# EAGLE design controlshield (EAGLE 6.3)
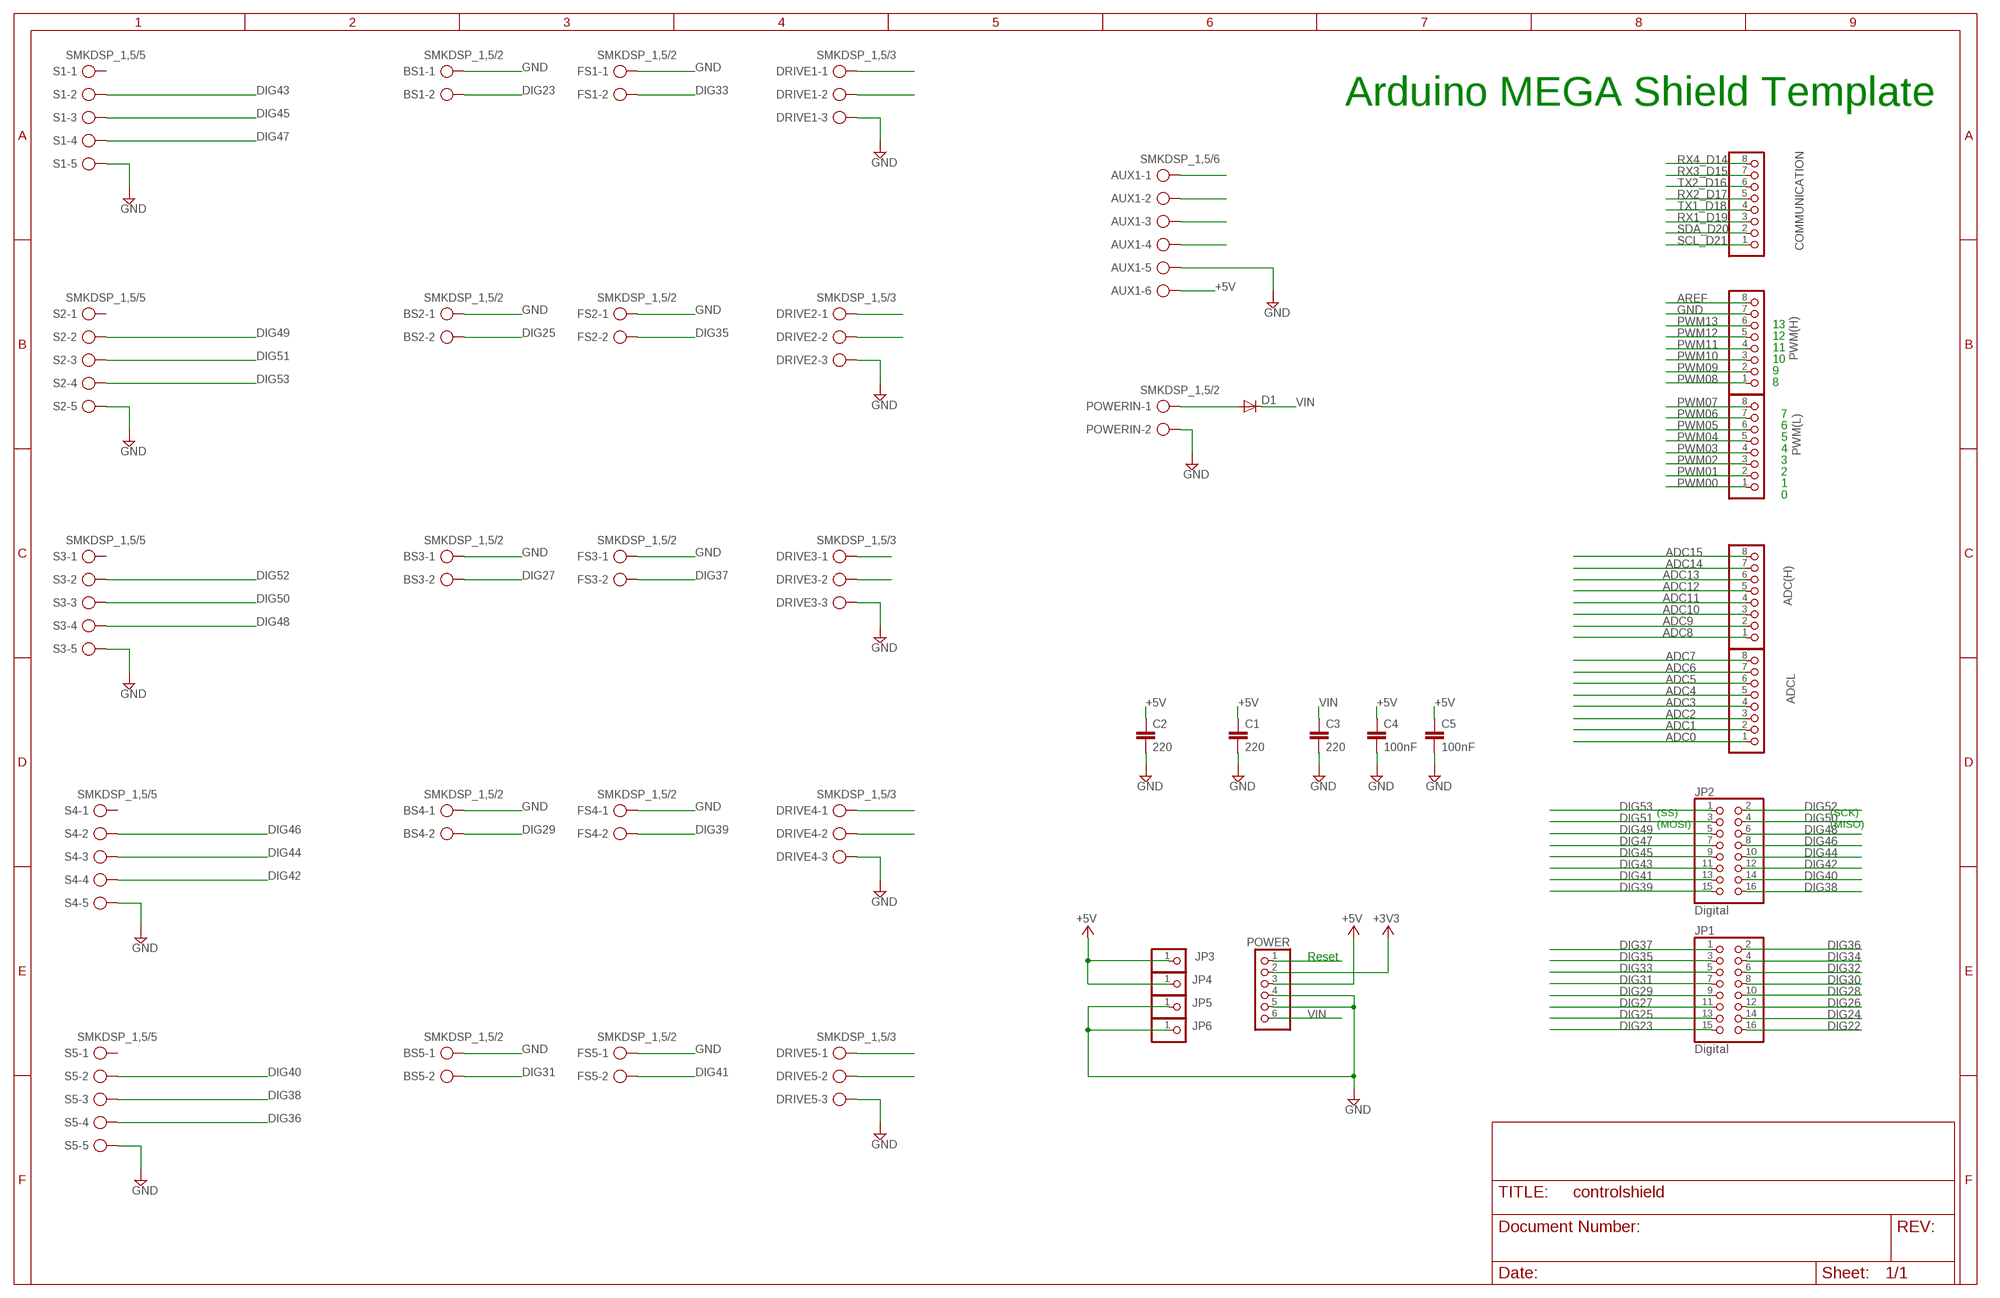
[diagram p0: schematic, sheet 1]

## Parts
ADC(H)  PINHD-1X8  [1X08]
ADCL  PINHD-1X8  [1X08]
AUX1  SMKDSP_1,5/6  [SMKDSP_1,5/6]
BS1  SMKDSP_1,5/2  [SMKDSP_1,5/2]
BS2  SMKDSP_1,5/2  [SMKDSP_1,5/2]
BS3  SMKDSP_1,5/2  [SMKDSP_1,5/2]
BS4  SMKDSP_1,5/2  [SMKDSP_1,5/2]
BS5  SMKDSP_1,5/2  [SMKDSP_1,5/2]
C1  220  C-EU050-075X075  [C050-075X075]
C2  220  C-EU050-075X075  [C050-075X075]
C3  220  C-EU050-075X075  [C050-075X075]
C4  100nF  CAPPTH1  [CAP-PTH-5MM]
C5  100nF  CAPPTH1  [CAP-PTH-5MM]
COMMUNICATION  PINHD-1X8  [1X08]
D1  DIODE-DO201-15  [DO201-15]
DRIVE1  SMKDSP_1,5/3  [SMKDSP_1,5/3]
DRIVE2  SMKDSP_1,5/3  [SMKDSP_1,5/3]
DRIVE3  SMKDSP_1,5/3  [SMKDSP_1,5/3]
DRIVE4  SMKDSP_1,5/3  [SMKDSP_1,5/3]
DRIVE5  SMKDSP_1,5/3  [SMKDSP_1,5/3]
FS1  SMKDSP_1,5/2  [SMKDSP_1,5/2]
FS2  SMKDSP_1,5/2  [SMKDSP_1,5/2]
FS3  SMKDSP_1,5/2  [SMKDSP_1,5/2]
FS4  SMKDSP_1,5/2  [SMKDSP_1,5/2]
FS5  SMKDSP_1,5/2  [SMKDSP_1,5/2]
JP1  Digital  PINHD-2X8  [2X08]
JP2  Digital  PINHD-2X8  [2X08]
JP3  PINHD-1X1  [1X01]
JP4  PINHD-1X1  [1X01]
JP5  PINHD-1X1  [1X01]
JP6  PINHD-1X1  [1X01]
POWER  PINHD-1X6  [1X06]
POWERIN  SMKDSP_1,5/2  [SMKDSP_1,5/2]
PWM(H)  PINHD-1X8  [1X08]
PWM(L)  PINHD-1X8  [1X08]
S1  SMKDSP_1,5/5  [SMKDSP_1,5/5]
S2  SMKDSP_1,5/5  [SMKDSP_1,5/5]
S3  SMKDSP_1,5/5  [SMKDSP_1,5/5]
S4  SMKDSP_1,5/5  [SMKDSP_1,5/5]
S5  SMKDSP_1,5/5  [SMKDSP_1,5/5]

## Nets
+3V3 [power]: POWER.2
+5V [usbvcc]: AUX1.6 C1.1 C2.1 C4.1 C5.1 JP3.1 JP4.1 POWER.3
ADC0: ADCL.1
ADC1: ADCL.2
ADC2: ADCL.3
ADC3: ADCL.4
ADC4: ADCL.5
ADC5: ADCL.6
ADC6: ADCL.7
ADC7: ADCL.8
ADC8: ADC(H).1
ADC9: ADC(H).2
ADC10: ADC(H).3
ADC11: ADC(H).4
ADC12: ADC(H).5
ADC13: ADC(H).6
ADC14: ADC(H).7
ADC15: ADC(H).8
AREF: PWM(H).8
DIG22: DRIVE1.1 JP1.16
DIG23: BS1.2 JP1.15
DIG24: DRIVE1.2 JP1.14
DIG25: BS2.2 JP1.13
DIG26 [gnd]: DRIVE2.1 JP1.12
DIG27: BS3.2 JP1.11
DIG28: DRIVE2.2 JP1.10
DIG29: BS4.2 JP1.9
DIG30: JP1.8
DIG31: BS5.2 JP1.7
DIG32: JP1.6
DIG33: FS1.2 JP1.5
DIG34: JP1.4
DIG35: FS2.2 JP1.3
DIG36: JP1.2 S5.4
DIG37: FS3.2 JP1.1
DIG38: JP2.16 S5.3
DIG39: FS4.2 JP2.15
DIG40: JP2.14 S5.2
DIG41: FS5.2 JP2.13
DIG42: JP2.12 S4.4
DIG43: JP2.11 S1.2
DIG44: JP2.10 S4.3
DIG45: JP2.9 S1.3
DIG46: JP2.8 S4.2
DIG47: JP2.7 S1.4
DIG48: JP2.6 S3.4
DIG49: JP2.5 S2.2
DIG50: JP2.4 S3.3
DIG51: JP2.3 S2.3
DIG52: JP2.2 S3.2
DIG53: JP2.1 S2.4
GND [gnd]: AUX1.5 BS1.1 BS2.1 BS3.1 BS4.1 BS5.1 C1.2 C2.2 C3.2 C4.2 C5.2 DRIVE1.3 DRIVE2.3 DRIVE3.3 DRIVE4.3 DRIVE5.3 FS1.1 FS2.1 FS3.1 FS4.1 FS5.1 JP5.1 JP6.1 POWER.4 POWER.5 POWERIN.2 PWM(H).7 S1.5 S2.5 S3.5 S4.5 S5.5
N$1: D1.A POWERIN.1
PWM00: PWM(L).1
PWM01: PWM(L).2
PWM02: PWM(L).3
PWM03: DRIVE3.1 PWM(L).4
PWM04: DRIVE3.2 PWM(L).5
PWM05: DRIVE4.1 PWM(L).6
PWM06: DRIVE4.2 PWM(L).7
PWM07: DRIVE5.1 PWM(L).8
PWM08: DRIVE5.2 PWM(H).1
PWM09: AUX1.1 PWM(H).2
PWM10: AUX1.2 PWM(H).3
PWM11: AUX1.3 PWM(H).4
PWM12: AUX1.4 PWM(H).5
PWM13: PWM(H).6
RESET: POWER.1
RX1_D19: COMMUNICATION.3
RX2_D17: COMMUNICATION.5
RX3_D15: COMMUNICATION.7
RX4_D14: COMMUNICATION.8
SCL_D21: COMMUNICATION.1
SDA_D20: COMMUNICATION.2
TX1_D18: COMMUNICATION.4
TX2_D16: COMMUNICATION.6
VIN [power]: C3.1 D1.C POWER.6
Unconnected: S1.1 S2.1 S3.1 S4.1 S5.1

## Notes on the sheet
- Arduino MEGA Shield Template
- 13
- 12
- 11
- 10
- 9
- 8
- 7
- 6
- 5
- 4
- 3
- 2
- 1
- 0
- (SS) | (SCK)
- (MOSI) | (MISO)
- Reset

## Library data of the parts
ADC(H) ADCL COMMUNICATION PWM(H) PWM(L) = pinhead:PINHD-1X8: PIN HEADER
AUX1 = con-phoenix-smkdsp:SMKDSP_1,5/6: Printklemme, Nennstrom: 17,5 A, Bemessungsspannung: 250 V, Raster: 5,0 mm Source: http://eshop.phoenixcontact.de .. 1733415.pdf; MF: FARNELL; MPN: 1733619; OC_FARNELL: 3041270; OC_NEWARK: 71C4132
BS1-BS5 FS1-FS5 POWERIN = con-phoenix-smkdsp:SMKDSP_1,5/2: Printklemme, Nennstrom: 17,5 A, Bemessungsspannung: 250 V, Raster: 5,0 mm Source: http://eshop.phoenixcontact.de .. 1733415.pdf; MF: FARNELL; MPN: 1733570; OC_FARNELL: 3041244; OC_NEWARK: 69C8588
C1-C3 = rcl:C-EU: CAPACITOR, European symbol
C4 C5 = SparkFun-Capacitors:CAP: Capacitor Standard 0603 ceramic capacitor, and 0.1" leaded capacitor.
D1 = diode:DIODE-: DIODE
DRIVE1-DRIVE5 = con-phoenix-smkdsp:SMKDSP_1,5/3: Printklemme, Nennstrom: 17,5 A, Bemessungsspannung: 250 V, Raster: 5,0 mm Source: http://eshop.phoenixcontact.de .. 1733415.pdf; MF: FARNELL; MPN: 1733583; OC_FARNELL: 3041256; OC_NEWARK: 71C4130
JP1 JP2 = pinhead:PINHD-2X8: PIN HEADER
JP3-JP6 = pinhead:PINHD-1X1: PIN HEADER
POWER = pinhead:PINHD-1X6: PIN HEADER
S1-S5 = con-phoenix-smkdsp:SMKDSP_1,5/5: Printklemme, Nennstrom: 17,5 A, Bemessungsspannung: 250 V, Raster: 5,0 mm Source: http://eshop.phoenixcontact.de .. 1733415.pdf; OC_FARNELL: unknown; OC_NEWARK: unknown

## Net classes
0 default: width 0.203 mm, drill 0.406 mm, clearance 0.203 mm
1 power: width 0.61 mm, drill 0.711 mm, clearance 0.203 mm
2 gnd: width 0.305 mm, drill 0.711 mm, clearance 0.203 mm
3 usbvcc: width 0.508 mm, drill 0.711 mm, clearance 0.203 mm

## Board
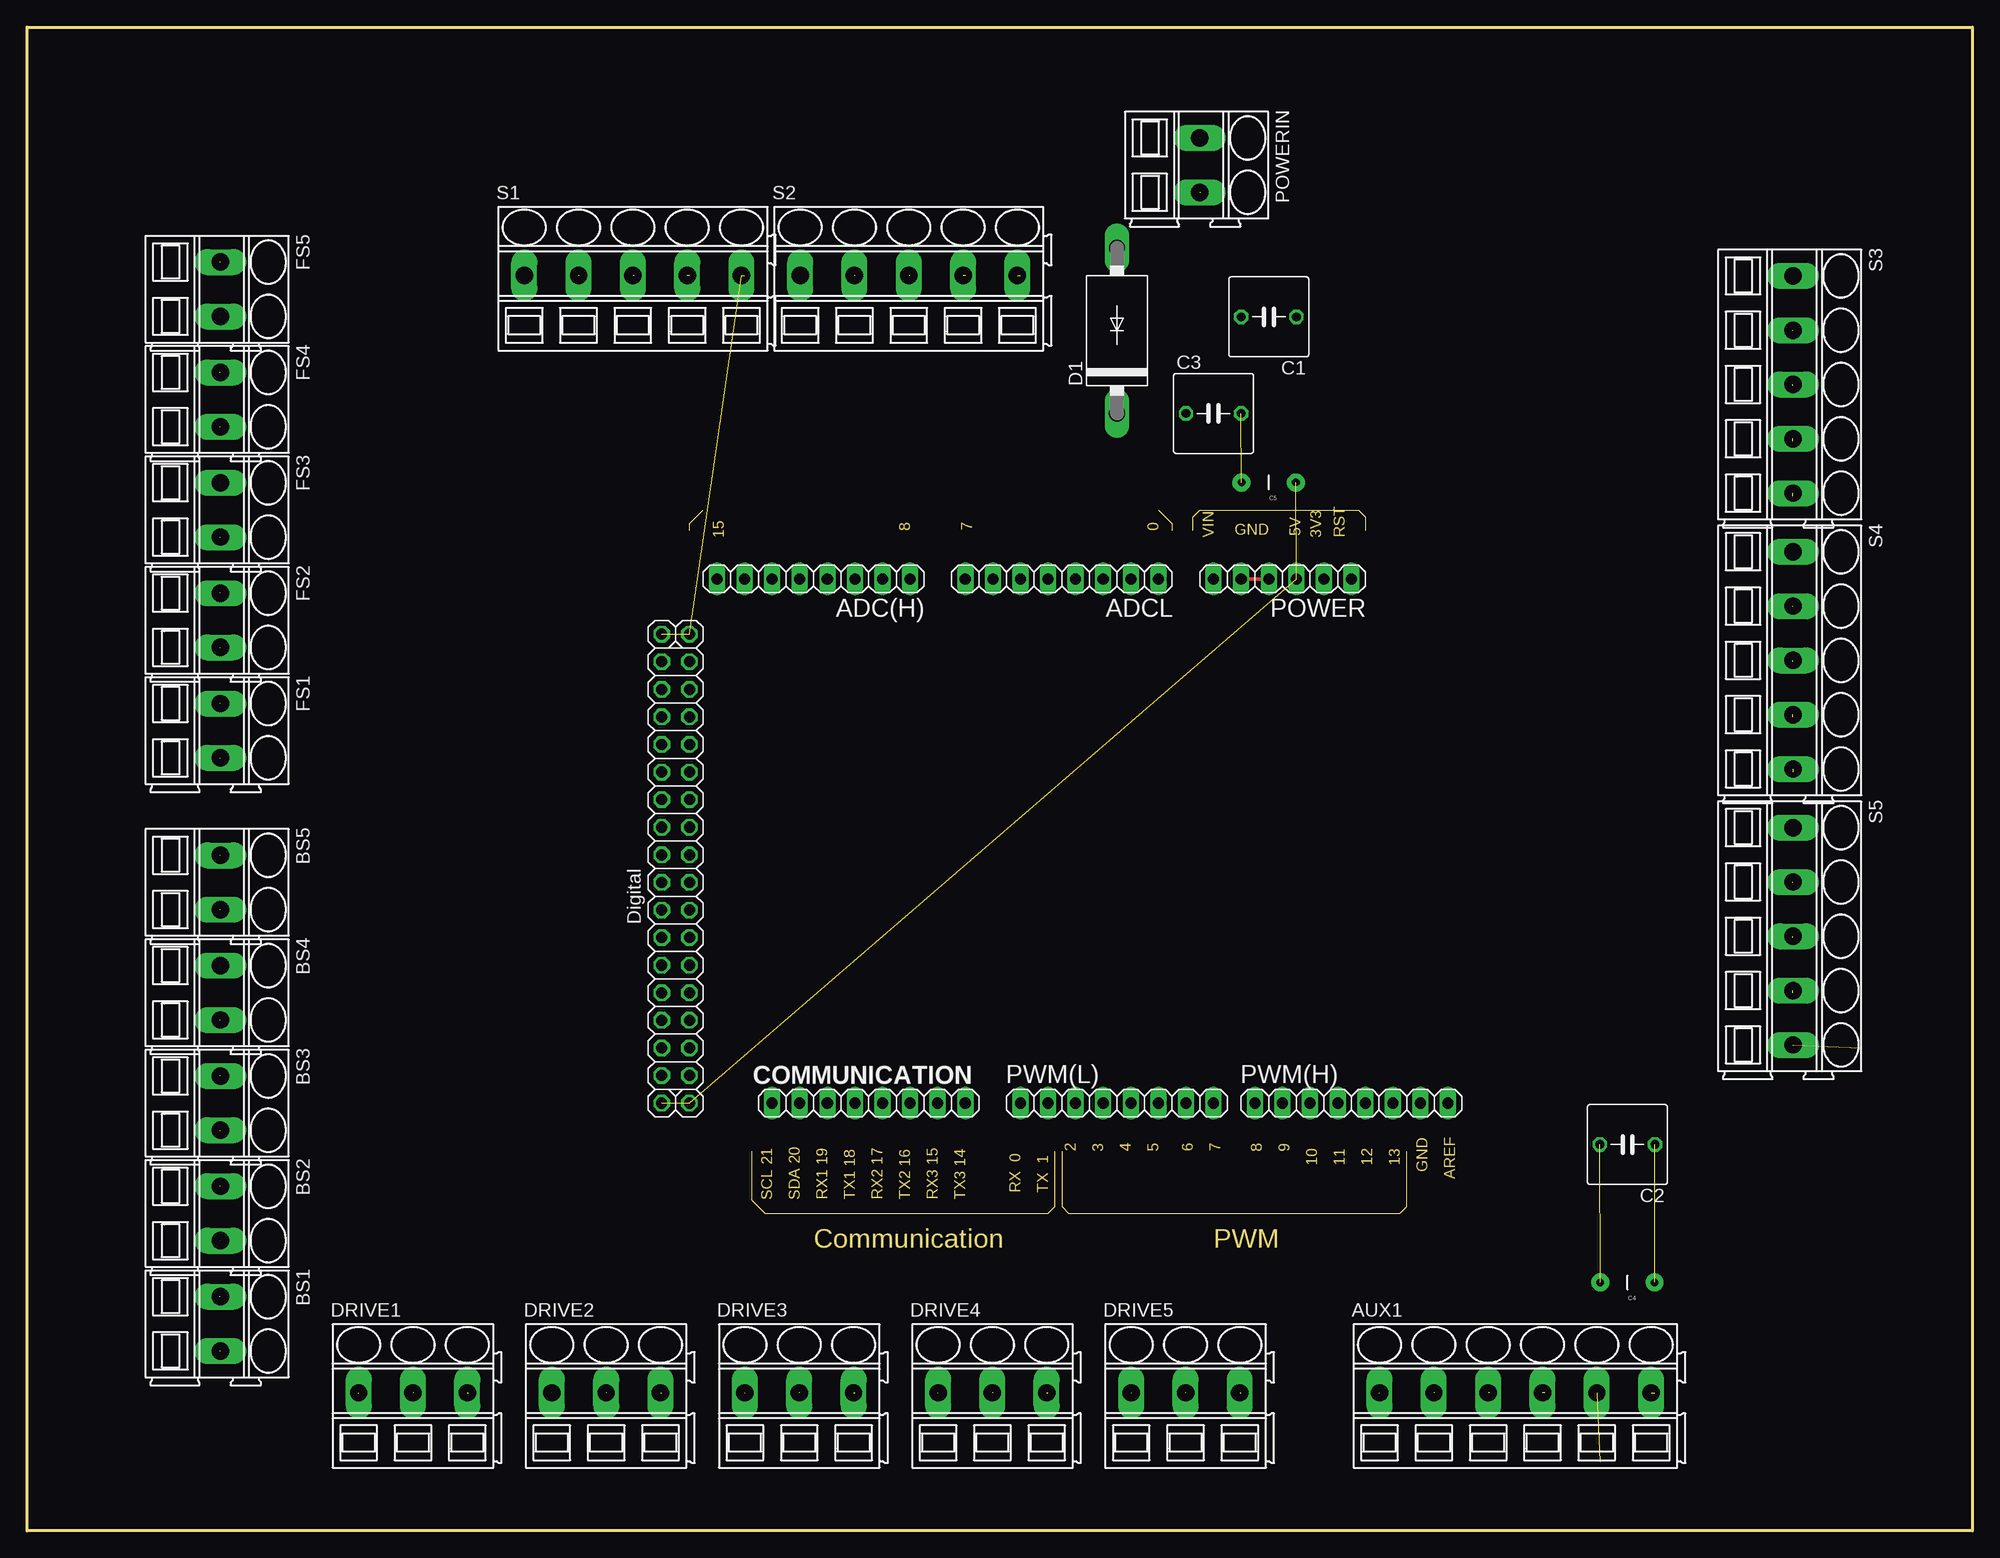
[diagram p1: board, top side]
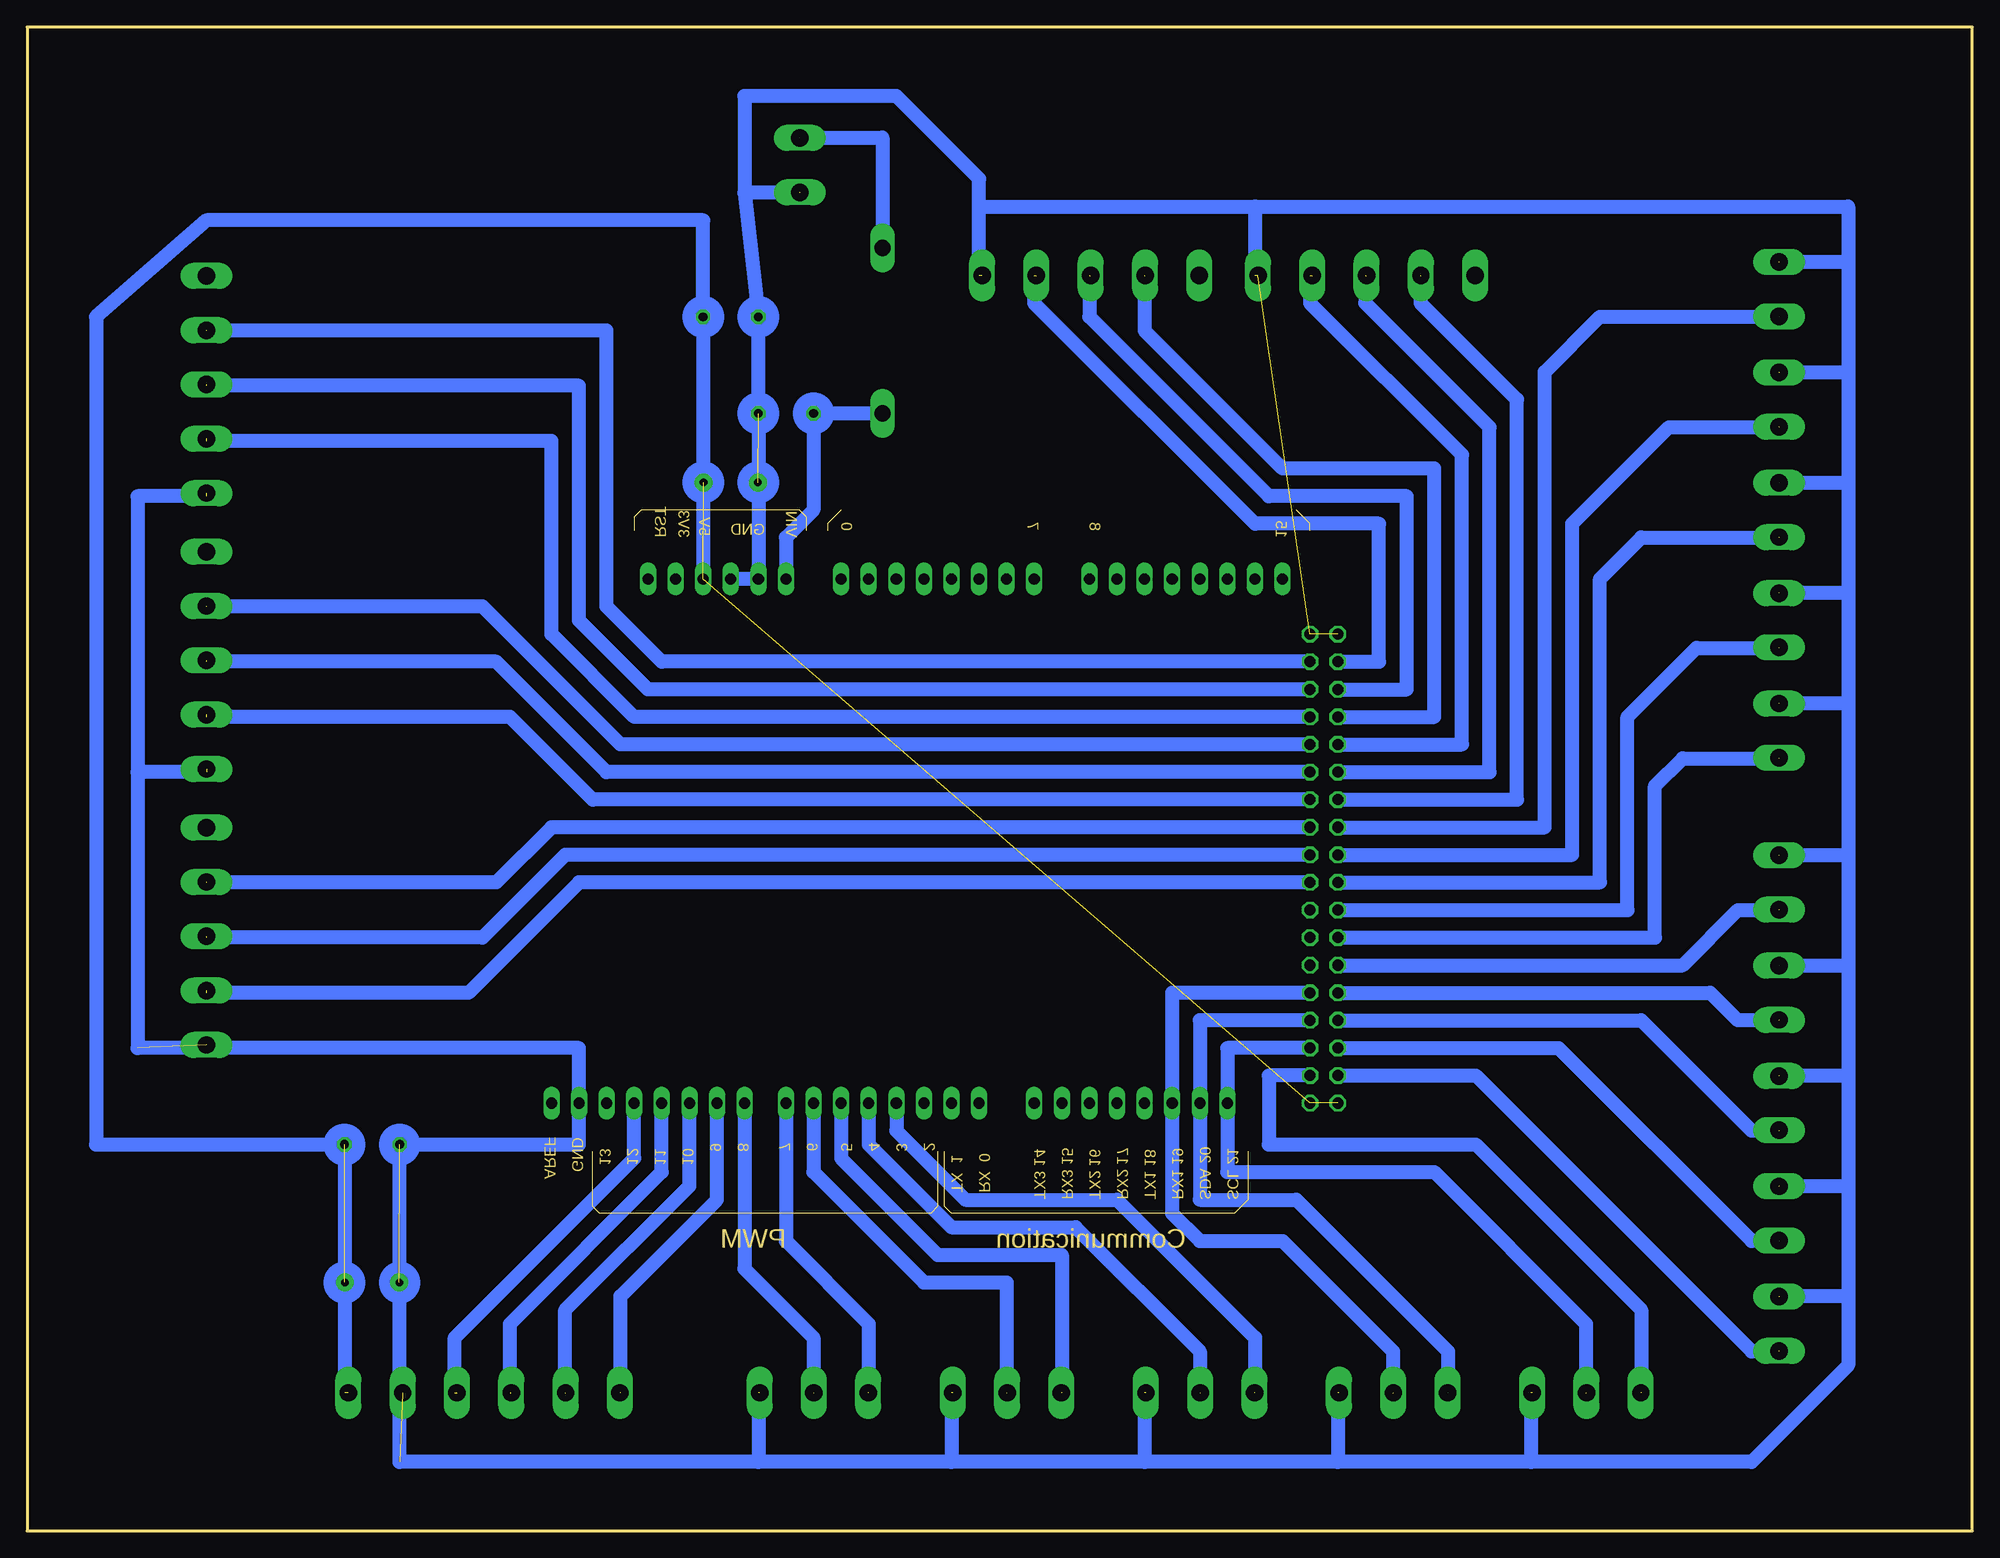
[diagram p2: board, bottom side, seen from below]

Size 179.07 x 138.43 mm. Coordinates in mm from the lower left corner, seen from the top.
Outline: 60.96,92.08 60.96,92.71 62.23,93.98
Outline: 104.14,93.98 105.41,92.71 105.41,92.08
Outline: 107.31,92.08 107.31,93.34 107.95,93.98 122.56,93.98 123.19,93.34 123.19,92.08
Outline: 66.68,34.92 66.68,30.48 67.95,29.21 93.98,29.21 94.62,29.84 94.62,34.92
Outline: 95.25,34.92 95.25,29.84 95.89,29.21 126.37,29.21 127,29.84 127,34.92
Outline: 179.07,0 0,0 0,138.43 179.07,138.43 179.07,0
Copper layers (1*16): Top 0.035mm / dielectric 1.5mm / Bottom 0.035mm
Design rules "default *": minimum track width 8mil, minimum drill 16mil, track to track 10mil, track to pad 8mil, pad to pad 8mil, via to via 10mil, smd to smd 8mil, copper to edge 40mil, drill to drill 12mil, minimum pad ring 10mil, minimum via ring 10mil, stop-mask expansion 4mil, vias tented up to drill 0mil, thermal gap 10mil

### Footprints (pad centres in the part's own frame; a part is rotated, then mirrored left to right if it is on the bottom)
1X08 = drill 1.016 long: 1 -8.89,0; 2 -6.35,0; 3 -3.81,0; 4 -1.27,0; 5 1.27,0; 6 3.81,0; 7 6.35,0; 8 8.89,0
SMKDSP_1,5/6 = drill 1.6 pad 1.8 long: 1 -2.5,0; 2 2.5,0; 3 7.5,0; 4 12.5,0; 5 17.5,0; 6 22.5,0
SMKDSP_1,5/2 = drill 1.6 pad 1.8 long: 1 -2.5,0; 2 2.5,0
C050-075X075 = drill 0.813 octagon: 1 -2.54,0; 2 2.54,0
CAP-PTH-5MM = drill 0.7 pad 1.651: 1 -2.5,0; 2 2.5,0
DO201-15 = drill 1.499 long: A 7.62,0; C -7.62,0
SMKDSP_1,5/3 = drill 1.6 pad 1.8 long: 1 -2.5,0; 2 2.5,0; 3 7.5,0
2X08 = drill 1.016 octagon: 1 -8.89,-1.27; 2 -8.89,1.27; 3 -6.35,-1.27; 4 -6.35,1.27; 5 -3.81,-1.27; 6 -3.81,1.27; 7 -1.27,-1.27; 8 -1.27,1.27; 9 1.27,-1.27; 10 1.27,1.27; 11 3.81,-1.27; 12 3.81,1.27; 13 6.35,-1.27; 14 6.35,1.27; 15 8.89,-1.27; 16 8.89,1.27
1X01 = drill 1.016 octagon: 1 0,0
1X06 = drill 1.016 long: 1 -6.35,0; 2 -3.81,0; 3 -1.27,0; 4 1.27,0; 5 3.81,0; 6 6.35,0
SMKDSP_1,5/5 = drill 1.6 pad 1.8 long: 1 -2.5,0; 2 2.5,0; 3 7.5,0; 4 12.5,0; 5 17.5,0

### Placement (x,y rotation side)
ADC(H)  72.39,87.63 180 top
ADCL  95.25,87.63 180 top
AUX1  127,12.7 0 top
BS1  17.78,19.05 270 top
BS2  17.78,29.21 270 top
BS3  17.78,39.37 270 top
BS4  17.78,49.53 270 top
BS5  17.78,59.69 270 top
C1  114.3,111.76 180 top
C2  147.32,35.56 180 top
C3  109.22,102.87 0 top
C4  147.32,22.86 180 top
C5  114.3,96.52 180 top
COMMUNICATION  77.47,39.37 0 top
D1  100.33,110.49 90 top
DRIVE1  33.02,12.7 0 top
DRIVE2  50.8,12.7 0 top
DRIVE3  68.58,12.7 0 top
DRIVE4  86.36,12.7 0 top
DRIVE5  104.14,12.7 0 top
FS1  17.78,73.66 270 top
FS2  17.78,83.82 270 top
FS3  17.78,93.98 270 top
FS4  17.78,104.14 270 top
FS5  17.78,114.3 270 top
JP1  59.69,50.8 270 top
JP2  59.69,71.12 270 top
JP3  60.96,39.37 180 top
JP4  58.42,39.37 180 top
JP5  60.96,82.55 180 top
JP6  58.42,82.55 180 top
POWER  115.57,87.63 180 top
POWERIN  107.95,125.73 270 top
PWM(H)  121.92,39.37 0 top
PWM(L)  100.33,39.37 0 top
S1  48.26,115.57 0 top
S2  73.66,115.57 0 top
S3  162.56,113.03 270 top
S4  162.56,87.63 270 top
S5  162.56,62.23 270 top

### Tracks (layer width: path | path; a pad name or v marks a point on that pad's centre or on a via)
+5V  (5 unrouted)
  Bottom 1.27: 149.86,12.7 C2.1 172.72,35.56 172.72,111.76 162.56,120.65 116.84,120.65 C1.1 POWER.3
DIG22  (1 unrouted)
  Bottom 1.27: JP1.16 64.77,41.91 64.77,35.56 45.72,35.56 30.48,20.32 30.48,12.7
DIG23  (1 unrouted)
  Bottom 1.27: JP1.15 45.72,41.91 20.32,16.51 17.78,16.51
DIG24  (1 unrouted)
  Bottom 1.27: JP1.14 68.58,44.45 68.58,33.02 49.53,33.02 35.56,19.05 35.56,12.7
DIG25  (1 unrouted)
  Bottom 1.27: JP1.13 38.1,44.45 20.32,26.67 17.78,26.67
DIG26  (1 unrouted)
  Bottom 1.27: JP1.12 71.12,46.99 71.12,30.48 62.23,30.48 48.26,16.51 48.26,12.7
DIG27  (1 unrouted)
  Bottom 1.27: JP1.11 30.48,46.99 20.32,36.83 17.78,36.83
DIG28  (1 unrouted)
  Bottom 1.27: JP1.10 73.66,49.53 73.66,29.21 71.12,26.67 63.5,26.67 53.34,16.51 53.34,12.7
DIG29  (1 unrouted)
  Bottom 1.27: JP1.9 24.13,49.53 21.59,46.99 17.78,46.99
DIG31  (1 unrouted)
  Bottom 1.27: JP1.7 26.67,52.07 21.59,57.15 17.78,57.15
DIG33  (1 unrouted)
  Bottom 1.27: JP1.5 29.21,54.61 29.21,68.58 26.67,71.12 17.78,71.12
DIG35  (1 unrouted)
  Bottom 1.27: JP1.3 31.75,57.15 31.75,74.93 25.4,81.28 17.78,81.28
DIG36  (1 unrouted)
  Bottom 1.27: JP1.2 128.27,59.69 138.43,49.53 162.56,49.53
DIG37  (1 unrouted)
  Bottom 1.27: JP1.1 34.29,59.69 34.29,87.63 30.48,91.44 17.78,91.44
DIG38  (1 unrouted)
  Bottom 1.27: JP2.16 129.54,62.23 137.16,54.61 162.56,54.61
DIG39  (1 unrouted)
  Bottom 1.27: JP2.15 36.83,62.23 36.83,92.71 27.94,101.6 17.78,101.6
DIG40  (1 unrouted)
  Bottom 1.27: JP2.14 130.81,64.77 135.89,59.69 162.56,59.69
DIG41  (1 unrouted)
  Bottom 1.27: JP2.13 39.37,64.77 39.37,106.68 34.29,111.76 17.78,111.76
DIG42  (1 unrouted)
  Bottom 1.27: JP2.12 127,67.31 134.62,74.93 162.56,74.93
DIG43  (1 unrouted)
  Bottom 1.27: JP2.11 41.91,67.31 41.91,104.14 50.8,113.03 50.8,115.57
DIG44  (1 unrouted)
  Bottom 1.27: JP2.10 125.73,69.85 135.89,80.01 162.56,80.01
DIG45  (1 unrouted)
  Bottom 1.27: JP2.9 44.45,69.85 44.45,101.6 55.88,113.03 55.88,115.57
DIG46  (1 unrouted)
  Bottom 1.27: JP2.8 124.46,72.39 137.16,85.09 162.56,85.09
DIG47  (1 unrouted)
  Bottom 1.27: JP2.7 46.99,72.39 46.99,99.06 60.96,113.03 60.96,115.57
DIG48  (1 unrouted)
  Bottom 1.27: JP2.6 123.19,74.93 130.81,82.55 130.81,100.33 162.56,100.33
DIG49  (1 unrouted)
  Bottom 1.27: JP2.5 49.53,74.93 49.53,97.79 63.5,97.79 76.2,110.49 76.2,115.57
DIG50  (1 unrouted)
  Bottom 1.27: JP2.4 121.92,77.47 128.27,83.82 128.27,105.41 162.56,105.41
DIG51  (1 unrouted)
  Bottom 1.27: JP2.3 52.07,77.47 52.07,95.25 64.77,95.25 81.28,111.76 81.28,115.57
DIG52  (1 unrouted)
  Bottom 1.27: JP2.2 120.65,80.01 125.73,85.09 125.73,110.49 162.56,110.49
DIG53  (1 unrouted)
  Bottom 1.27: JP2.1 54.61,80.01 54.61,92.71 66.04,92.71 86.36,113.03 86.36,115.57
GND  (26 unrouted)
  Top 0.305: POWER.5 POWER.4
  Bottom 1.27: 168.91,69.85 168.91,95.25 162.56,95.25 | 168.91,69.85 168.91,44.45 128.27,44.45 PWM(H).7 128.27,35.56 C2.2 144.78,6.35 111.76,6.35 | 113.03,123.19 C1.2 C3.2 POWER.5 POWER.4 | 91.44,115.57 91.44,121.92 | 91.44,121.92 66.04,121.92 | 66.04,121.92 66.04,115.57 | 66.04,121.92 11.43,121.92 11.43,116.84 | 11.43,116.84 11.43,106.68 | 11.43,106.68 11.43,96.52 | 11.43,96.52 11.43,86.36 | 11.43,86.36 11.43,76.2 | 11.43,76.2 11.43,62.23 | 11.43,62.23 11.43,52.07 | 11.43,52.07 11.43,41.91 | 11.43,41.91 11.43,31.75 | 11.43,31.75 11.43,21.59 | 11.43,21.59 17.78,21.59 | 17.78,31.75 11.43,31.75 | 17.78,41.91 11.43,41.91 | 17.78,52.07 11.43,52.07 | 17.78,62.23 11.43,62.23 | 17.78,76.2 11.43,76.2 | 17.78,86.36 11.43,86.36 | 17.78,96.52 11.43,96.52 | 17.78,106.68 11.43,106.68 | 17.78,116.84 11.43,116.84 | 11.43,21.59 11.43,15.24 20.32,6.35 40.64,6.35 | 40.64,6.35 58.42,6.35 | 58.42,6.35 76.2,6.35 | 93.98,6.35 111.76,6.35 | 40.64,12.7 40.64,6.35 | 58.42,12.7 58.42,6.35 | 76.2,12.7 76.2,6.35 | 111.76,12.7 111.76,6.35 | 76.2,6.35 93.98,6.35 | 93.98,12.7 93.98,6.35 | 113.03,123.19 113.03,132.08 99.06,132.08 91.44,124.46 91.44,121.92 | 107.95,123.19 113.03,123.19 | 162.56,69.85 168.91,69.85
N$1  (1 unrouted)
  Bottom 1.27: 107.95,128.27 100.33,128.27 D1.A
PWM03  (1 unrouted)
  Bottom 1.27: PWM(L).4 99.06,36.83 92.71,30.48 78.74,30.48 66.04,17.78 66.04,12.7
PWM04  (1 unrouted)
  Bottom 1.27: PWM(L).5 101.6,35.56 93.98,27.94 82.55,27.94 71.12,16.51 71.12,12.7
PWM05  (1 unrouted)
  Bottom 1.27: PWM(L).6 104.14,34.29 95.25,25.4 83.82,25.4 83.82,12.7
PWM06  (1 unrouted)
  Bottom 1.27: PWM(L).7 106.68,33.02 96.52,22.86 88.9,22.86 88.9,12.7
PWM07  (1 unrouted)
  Bottom 1.27: PWM(L).8 109.22,26.67 101.6,19.05 101.6,12.7
PWM08  (1 unrouted)
  Bottom 1.27: PWM(H).1 113.03,24.13 106.68,17.78 106.68,12.7
PWM09  (1 unrouted)
  Bottom 1.27: 124.46,12.7 124.46,21.59 115.57,30.48 PWM(H).2
PWM10  (1 unrouted)
  Bottom 1.27: 129.54,12.7 129.54,20.32 118.11,31.75 PWM(H).3
PWM11  (1 unrouted)
  Bottom 1.27: 134.62,12.7 134.62,19.05 120.65,33.02 PWM(H).4
PWM12  (1 unrouted)
  Bottom 1.27: 139.7,12.7 139.7,17.78 123.19,34.29 PWM(H).5
VIN
  Bottom 1.27: POWER.6 109.22,91.44 106.68,93.98 C3.1 D1.C
(copper drawn outside any net)
  shapes: Bottom circle x10

### Text on the board
Dimension: 5V | 3V3 | GND | 15 | 8 | 7 | 0 | VIN | RST | 2 | 3 | 4 | 5 | 6 | 7 | 8 | 9 | 10 | 11 | 12 | 13 | GND | AREF | SCL 21 | SDA 20 | RX1 19 | TX1 18 | RX2 17 | TX2 16 | RX3 15 | TX3 14 | RX 0 | TX 1 | Communication | PWM
tOrigins: Analog In | Power